# Altium schematic sheet Connectors.SchDoc
size A; SheetNumber: 4; SheetTotal: 6
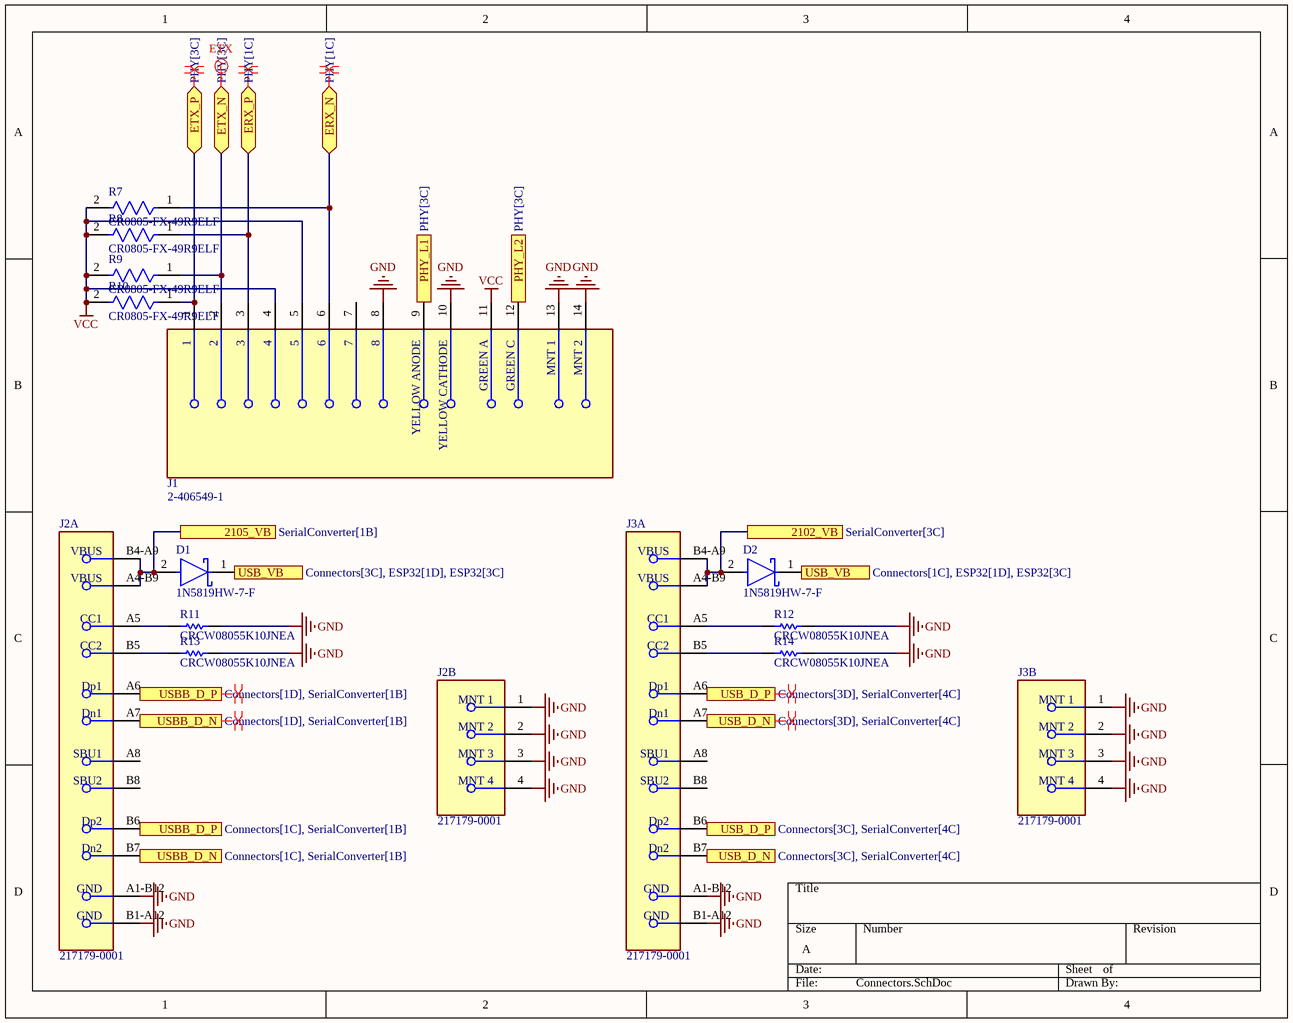
[diagram p0: Connectors.SchDoc]

## Parts
D1  1N5819HW-7-F  [FP-SOD123-IPC_A]
D2  1N5819HW-7-F  [FP-SOD123-IPC_A]
J1  2-406549-1  [FP-2-406549-1-MFG]
J2  217179-0001  [FP-217179-0001-MFG]  (parts A,B of 2)
J3  217179-0001  [FP-217179-0001-MFG]  (parts A,B of 2)
R7  CR0805-FX-49R9ELF  [FP-CR0805-MFG]
R8  CR0805-FX-49R9ELF  [FP-CR0805-MFG]
R9  CR0805-FX-49R9ELF  [FP-CR0805-MFG]
R10  CR0805-FX-49R9ELF  [FP-CR0805-MFG]
R11  CRCW08055K10JNEA  [RESC2013X50X30LL20T20]
R12  CRCW08055K10JNEA  [RESC2013X50X30LL20T20]
R13  CRCW08055K10JNEA  [RESC2013X50X30LL20T20]
R14  CRCW08055K10JNEA  [RESC2013X50X30LL20T20]

## Ports
2102_VB (see SerialConverter[3C]), 2105_VB (see SerialConverter[1B]), ERX_N (bidir, see PHY[1C]), ERX_P (bidir, see PHY[1C]), ETX_N (bidir, see PHY[3C]), ETX_P (bidir, see PHY[3C]), PHY_L1 (in, see PHY[3C]), PHY_L2 (out, see PHY[3C]), USB_D_N (see Connectors[3C], SerialConverter[4C]), USB_D_N (see Connectors[3D], SerialConverter[4C]), USB_D_P (see Connectors[3C], SerialConverter[4C]), USB_D_P (see Connectors[3D], SerialConverter[4C]), USB_VB (see Connectors[1C], ESP32[1D], ESP32[3C]), USB_VB (see Connectors[3C], ESP32[1D], ESP32[3C]), USBB_D_N (see Connectors[1C], SerialConverter[1B]), USBB_D_N (see Connectors[1D], SerialConverter[1B]), USBB_D_P (see Connectors[1C], SerialConverter[1B]), USBB_D_P (see Connectors[1D], SerialConverter[1B])

## Nets
GND: J1.8 J1.10(YELLOW_CATHODE) J1.13(MNT_1) J1.14(MNT_2) J2.1(MNT_1) J2.2(MNT_2) J2.3(MNT_3) J2.4(MNT_4) J2.A1-B12(GND) J2.B1-A12(GND) J3.1(MNT_1) J3.2(MNT_2) J3.3(MNT_3) J3.4(MNT_4) J3.A1-B12(GND) J3.B1-A12(GND) R11.2 R12.2 R13.2 R14.2
VCC: J1.4 J1.5 J1.11(GREEN_A) R7.2 R8.2 R9.2 R10.2
2102_VB: D2.2(A) J3.A4-B9(VBUS) J3.B4-A9(VBUS) ; port 2102_VB
2105_VB: D1.2(A) J2.A4-B9(VBUS) J2.B4-A9(VBUS) ; port 2105_VB
ERX_N: J1.6 R7.1 ; port ERX_N
ERX_P: J1.3 R8.1 ; port ERX_P
ETX_N: J1.2 R9.1 ; port ETX_N
ETX_P: J1.1 R10.1 ; port ETX_P
PHY_L1: J1.9(YELLOW_ANODE) ; port PHY_L1
PHY_L2: J1.12(GREEN_C) ; port PHY_L2
USB_D_N: J3.A7(Dn1) J3.B7(Dn2) ; port USB_D_N
USB_D_P: J3.A6(Dp1) J3.B6(Dp2) ; port USB_D_P
USB_VB: D1.1(C) D2.1(C) ; port USB_VB
USBB_D_N: J2.A7(Dn1) J2.B7(Dn2) ; port USBB_D_N
USBB_D_P: J2.A6(Dp1) J2.B6(Dp2) ; port USBB_D_P
NetJ2_A5: J2.A5(CC1) R11.1
NetJ2_B5: J2.B5(CC2) R13.1
NetJ3_A5: J3.A5(CC1) R12.1
NetJ3_B5: J3.B5(CC2) R14.1

Not connected (* = marked no-connect by the designer): J1 7; J2 A8(SBU1) B8(SBU2); J3 A8(SBU1) B8(SBU2)

## Layout directives
differential pair: ERX_N, ERX_P, ETX_N, ETX_P, USB_D_N, USB_D_P, USBB_D_N, USBB_D_P

## Library data of the parts
D1 D2 = CMP-0303-00003-3: DIODE SCHOTTKY 40V 1A SOD123; Forward Voltage: 450mV; Capacitance: 110pF; Max Forward Surge Current (Ifsm): 25A; Peak Reverse Current: 50uA; Polarity: Standard; Element Configuration: Single; Max Power Dissipation: 450mW; Min Operating Temperature: -65°C; Package Quantity: 3000; Contact Plating: Tin; Weight: 0.000353oz; Max Repetitive Reverse Voltage (Vrrm): 40V; Max Reverse Voltage (DC): 40V; Height: 1.25mm; Average Rectified Current: 1A; Width: 1.7mm; Case/Package: SOD-123-2; Lead Free: Lead Free; Max Operating Temperature: 125°C; Current Rating: 1A; Termination: SMD/SMT; Forward Current: 1A; Radiation Hardening: No; Number of Pins: 2; Length: 2.85mm; Voltage Rating (DC): 40V; REACH SVHC: No SVHC; Peak Non-Repetitive Surge Current: 25A; Packaging: Tape and Reel; Output Current: 1A
J1 = CMP-2000-05541-2: CONN MOD JACK 8P8C R/A SHIELDED; Max Voltage Rating (AC): 150V; Number of Contacts: 8; PCB Mounting Orientation: Right Angle; Direction: Up; Pitch: 2.03mm; Number of Ports: 1; Gender: Female; Tail Length: 2.54mm; Current Rating: 1.5A; Keyed: No; Approvals: UL; PCB Thickness: 1.57mm; Element Configuration: Single; Connector Type: Jack; Color: Yellow; Max Operating Temperature: 85°C; Weight: 0.144729oz; Series: -; Orientation: Right Angle; Width: 17.27mm; Package Quantity: 63; Mount: Panel; Contact Plating: Gold; Length: 17.86mm; Depth: 15.75mm; Flammability Rating: UL94 V-0; Shielding: Shielded; Housing Material: Thermoplastic; Number of Positions Loaded: 8; Contact Material: Bronze; Voltage Rating: 150V; Packaging: Tray; Number of Positions: 8; Termination: Solder; Number of Rows: 1; Radiation Hardening: No; Min Operating Temperature: -40°C; RoHS Compliant: Yes; Housing Color: Black
J2 J3 = CMP-04767-000028-1: CONN RCP USB2.0 TYP C 24P SMD RA
R7-R10 = CMP-07231-001472-1: Thick Film Chip Resistors 0805 49.9Ω 0.125W 1% 100ppm/°C; Voltage Rating (DC): 150V; Power Rating: 125mW; Resistance: 49.9R; Contact Plating: Tin; Radiation Hardening: No; Height: 0.5mm; Tolerance: 1%; Temperature Coefficient: 100ppm/°C; Min Operating Temperature: -55°C; Thickness: 508um; Termination: SMD/SMT; Depth: 1.25mm; Length: 2mm; Number of Pins: 2; Military Standard: Not; Case Code (Metric): 2012; Package Quantity: 5000; Width: 1.25mm; Mount: Surface Mount; Case Code (Imperial): 0805; Max Operating Temperature: 155°C; Voltage Rating: 150V; Composition: Thick Film; Case/Package: 0805; Packaging: Tape and Reel; REACH SVHC: No SVHC
R11-R14 = CMP-2001-04025-1: Manufacturer: Vishay Dale; Part Number: CRCW08055K10JNEA